# Altium schematic sheet Lora_Eval_Module.SchDoc
size A4; SheetNumber: 1; SheetTotal: 1
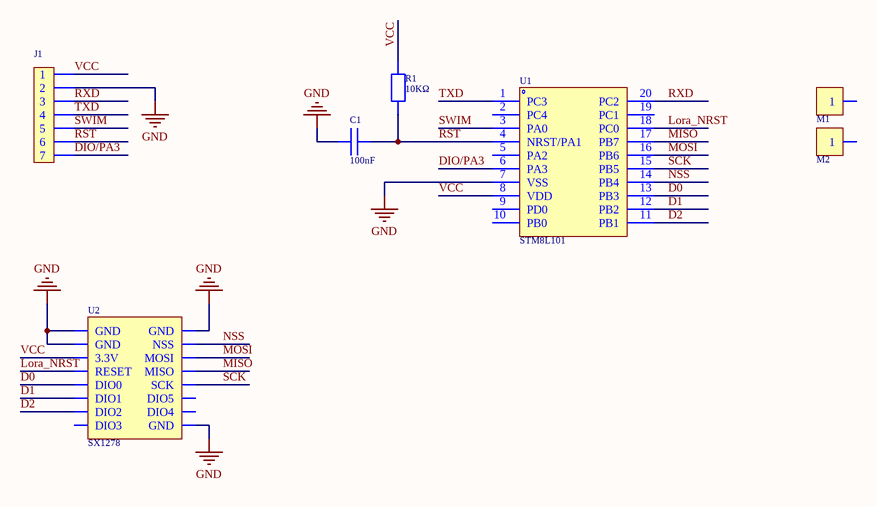
[diagram p0: Lora_Eval_Module.SchDoc]

## Parts
C1  100nF  [C0603]
J1  PinHeader_7Pin  [PinHeader_7Pin-2.54mm]  (value not drawn)
M1  PCB Mounting Hole  [PCB Mounting Hole]  (value not drawn)
M2  PCB Mounting Hole  [PCB Mounting Hole]  (value not drawn)
R1  10KΩ  [R0805]
U1  STM8L101  [TSSOP-20_4.4x6.5mm_P0.65mm]
U2  SX1278  [SX1278_Ra-02-Lora Module_Ai Thinker]

## Nets
GND: C1.1 J1.2 U1.7(VSS) U2.1(GND) U2.2(GND) U2.9(GND) U2.16(GND)
D0: U1.13(PB3) U2.5(DIO0)
D1: U1.12(PB2) U2.6(DIO1)
D2: U1.11(PB1) U2.7(DIO2)
DIO/PA3: J1.7 U1.6(PA3)
Lora_NRST: U1.18(PC0) U2.4(RESET)
MISO: U1.17(PB7) U2.13(MISO)
MOSI: U1.16(PB6) U2.14(MOSI)
NSS: U1.14(PB4) U2.15(NSS)
RST: C1.2 J1.6 R1.1 U1.4(NRST/PA1)
RXD: J1.3 U1.20(PC2)
SCK: U1.15(PB5) U2.12(SCK)
SWIM: J1.5 U1.3(PA0)
TXD: J1.4 U1.1(PC3)
VCC: J1.1 R1.2 U1.8(VDD) U2.3(3.3V)

Not connected (* = marked no-connect by the designer): M1 1; M2 1; U1 2(PC4) 5(PA2) 9(PD0) 10(PB0) 19(PC1); U2 8(DIO3) 10(DIO4) 11(DIO5)

## Library data of the parts
C1 = Capacitor_0603: Value: 100nF
M1 M2 = PCB Mounting Hole: Mounting Hole
R1 = Resistor_0805: Value: 10KΩ
U1 = STM8L101_TSSOP-20: 4.4x6.5mm_P0.65mm; Value: STM8L101
U2 = SX1278_Ra-02-Lora Module_Ai Thinker: Footprint from Manufacturer